# Altium schematic sheet Reference.SchDoc
size A3; SheetNumber: 7; SheetTotal: 8
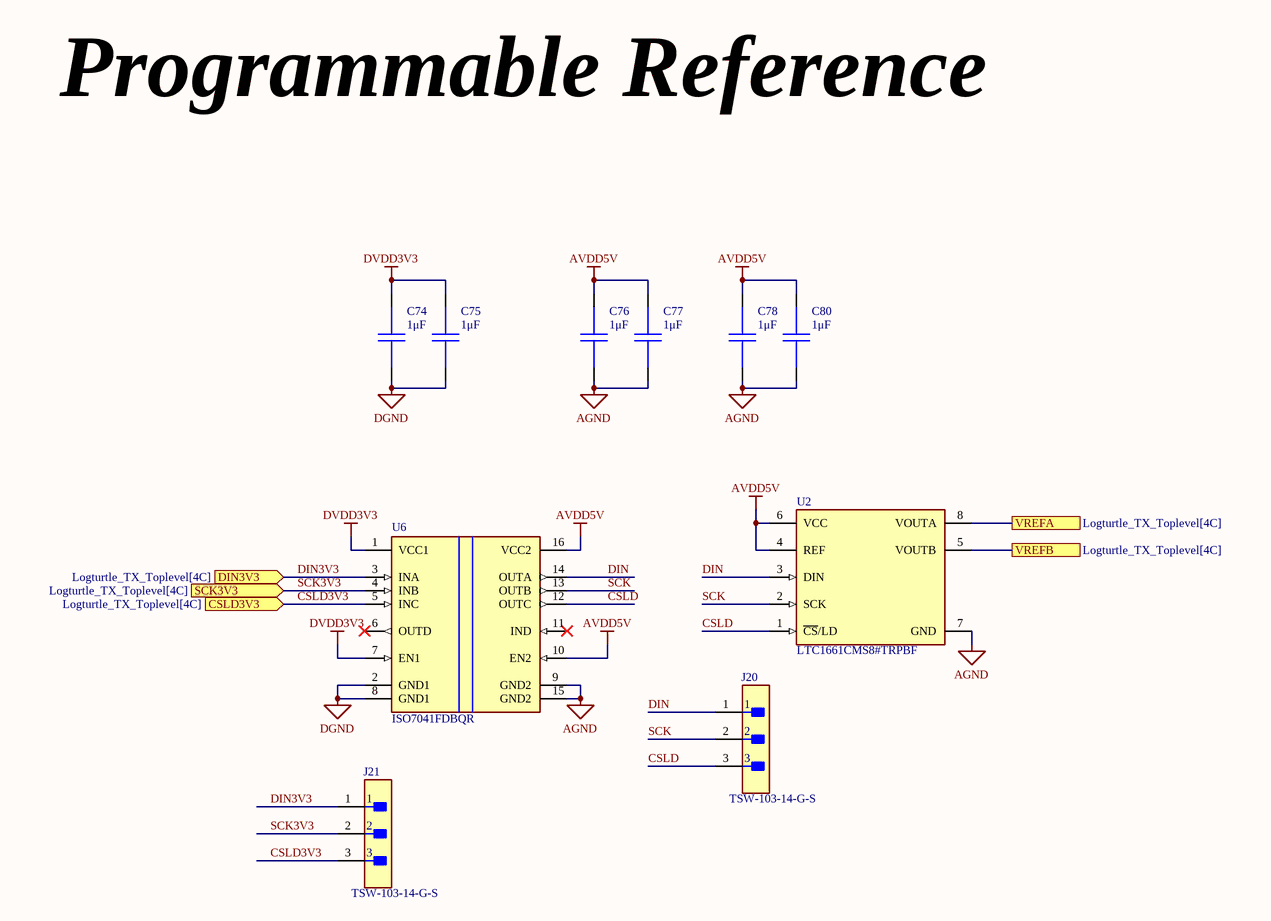
[diagram p0: Reference.SchDoc]

## Parts
C74  1μF  [CAPC1608X09N]
C75  1μF  [CAPC1608X09N]
C76  1μF  [CAPC1608X09N]
C77  1μF  [CAPC1608X09N]
C78  1μF  [CAPC1608X09N]
C80  1μF  [CAPC1608X09N]
J20  TSW-103-14-G-S  [FP-TSW-103-14-G-S-MFG]
J21  TSW-103-14-G-S  [FP-TSW-103-14-G-S-MFG]
U2  LTC1661CMS8#TRPBF  [FP-MS8-8-05-08-1660-IPC_B]
U6  ISO7041FDBQR  [FP-DBQ0016A-MFG]

## Ports
CSLD3V3 (in, see Logturtle_TX_Toplevel[4C]), DIN3V3 (in, see Logturtle_TX_Toplevel[4C]), SCK3V3 (in, see Logturtle_TX_Toplevel[4C]), VREFA (see Logturtle_TX_Toplevel[4C]), VREFB (see Logturtle_TX_Toplevel[4C])

## Nets
AGND: C76.1 C77.1 C78.1 C80.1 U2.7(GND) U6.9(GND2) U6.15(GND2)
AVDD5V: C76.2 C77.2 C78.2 C80.2 U2.4(REF) U2.6(VCC) U6.10(EN2) U6.16(VCC2)
DGND: C74.1 C75.1 U6.2(GND1) U6.8(GND1)
DVDD3V3: C74.2 C75.2 U6.1(VCC1) U6.7(EN1)
CSLD: J20.3 U2.1(~{CS}/LD) U6.12(OUTC)
CSLD3V3: J21.3 U6.5(INC) ; port CSLD3V3
DIN: J20.1 U2.3(DIN) U6.14(OUTA)
DIN3V3: J21.1 U6.3(INA) ; port DIN3V3
SCK: J20.2 U2.2(SCK) U6.13(OUTB)
SCK3V3: J21.2 U6.4(INB) ; port SCK3V3
VREFA: U2.8(VOUTA) ; port VREFA
VREFB: U2.5(VOUTB) ; port VREFB

Not connected (* = marked no-connect by the designer): U6 6(OUTD)* 11(IND)*

## Notes on the sheet
- Programmable Reference

## Library data of the parts
C74-C78 C80 = CC0603KRX7R7BB105: Ceramic Capacitor, Multilayer, Ceramic, 16V, 10% +Tol, 10% -Tol, X7R, 15% TC, 1uF, Surface Mount, 0603 https://www.digikey.ie/en/products/detail/yageo/CC0603KRX7R7BB105/2833611; Manufacturer: Yageo; Multilayer: Yes; Supplier: Digikey; Supplier Part Number: 311-1446-6-ND; Manufacturer Part Number: CC0603KRX7R7BB105; RoHS: Yes; Category: Ceramic Capacitors; Stock: 9128438; Mounting Technology: Surface Mount; Pins: 2; Dielectric Material: Ceramic; Package Shape: Rectangular; Case/Package: 0603; Terminal Finish: Nickel; Min Operating Temperature: -55°C; Max Operating Temperature: 125°C; JESD-609 Code: e3; Value: 1uF; Capacitor Type: Ceramic; Tolerance  (fill in as +-): 10%; Package Style: SMTMeter; Packaging: Tape and Reel; Tolerance (fill in as +-): 10%; Rated DC Voltage (URdc): 16V; Temperature Characteristics Code: X7R; Termination: Wraparound; Length: 1.6mm; Width: 0.8mm; Height: 0.8mm; Reach SVHC Compliant: Yes; RoHS Compliant: Yes; ComponentLink1URL: https://datasheet.ciiva.com:443/pdfs/VipMasterIC/IC/YAGO/YAGO-S-A0003557223/YAGO-S-A0003557223-1.pdf?src-supplier=IHS+Markit; ComponentLink1Description: https://datasheet.ciiva.com:443/pdfs/VipMasterIC/IC/YAGO/YAGO-S-A0003557223/YAGO-S-A0003557223-1.pdf?src-supplier=IHS+Markit; ComponentLink2URL: https://datasheet.ciiva.com/8033/1734573-8033801.pdf?src-supplier=Element14; ComponentLink2Description: https://datasheet.ciiva.com/8033/1734573-8033801.pdf?src-supplier=Element14; ComponentLink3URL: https://datasheet.ciiva.com/8033/1734573-8033800.pdf?src-supplier=Element14; ComponentLink3Description: https://datasheet.ciiva.com/8033/1734573-8033800.pdf?src-supplier=Element14; ComponentLink4URL: https://datasheet.ciiva.com/7978/1489800-7978143.pdf?src-supplier=Element14; ComponentLink4Description: https://datasheet.ciiva.com/7978/1489800-7978143.pdf?src-supplier=Element14; ComponentLink5URL: https://datasheet.ciiva.com/28450/1489800-28450557.pdf?src-supplier=Element14; ComponentLink5Description: https://datasheet.ciiva.com/28450/1489800-28450557.pdf?src-supplier=Element14; ComponentLink6URL: https://datasheet.ciiva.com/176/mlccorderingcode-176789.pdf?src-supplier=Digikey; ComponentLink6Description: https://datasheet.ciiva.com/176/mlccorderingcode-176789.pdf?src-supplier=Digikey; ComponentLink7URL: https://datasheet.ciiva.com/176/mlccorderingcode-176788.pdf?src-supplier=Digikey; ComponentLink7Description: https://datasheet.ciiva.com/176/mlccorderingcode-176788.pdf?src-supplier=Digikey; ComponentLink8URL: https://datasheet.ciiva.com/176/mlccorderingcode-176790.pdf?src-supplier=Digikey; ComponentLink8Description: https://datasheet.ciiva.com/176/mlccorderingcode-176790.pdf?src-supplier=Digikey; ComponentLink9URL: https://datasheet.ciiva.com/5425/upy-gphc-x7r-6-3v-to-50v-8-12304-5425495.pdf?src-supplier=Mouser; ComponentLink9Description: https://datasheet.ciiva.com/5425/upy-gphc-x7r-6-3v-to-50v-8-12304-5425495.pdf?src-supplier=Mouser
J20 J21 = CMP-02766-001743-1: CONN HEADER VERT 3POS 2.54MM; Max Voltage Rating (AC): 550V; Number of Positions: 3; Max Current Rating: 7.6A; Gender: Male; Termination: Solder; RoHS Compliant: Yes; Mount: Through Hole; Lead Free: Lead Free; Connector Type: Header; REACH SVHC: No SVHC; Insulation Color: Black; Width: 2.54mm; Length: 7.62mm; Flammability Rating: UL94 V-0; Housing Material: Polyester; Contact Material: Bronze; Max Operating Temperature: 125°C; Fastening Type: Pull; Series: TSW; Number of Contacts: 3; Packaging: Bulk; Min Operating Temperature: -55°C; Package Quantity: 1; Height: 10.67mm; Pitch: 2.54mm; Contact Finish - Mating: GOLD; Contact Type: Male Pin; Radiation Hardening: No; Color: Black; Housing Color: Black; Contact Plating: Gold; Orientation: Straight; Number of Rows: 1; Depth: 2.54mm; Insulation Material: PBT; Contact Mating Length: 0.32inch; Contact Shape: Square
U2 = CMP-09082-000102-1: IC DAC 10BIT V-OUT 8MSOP; Output Type: Voltage; Min Supply Voltage: 2.7V; Interface: Serial; Integral Nonlinearity (INL): 2LSB; Resolution: 10b; Max Supply Voltage: 5.5V; Number of Bits: 10; Supply Type: Single; Settling Time: 30us; Number of Converters: 2; Min Operating Temperature: 0°C; Lead Free: Lead Free; Number of Pins: 8; Packaging: Tape and Reel; Mount: Surface Mount; Max Operating Temperature: 70°C; Package Quantity: 2500; Number of Channels: 2; Case/Package: MSOP
U6 = CMP-04872-000242-1: DGTL ISO 3000VRMS 4CH GP 16SSOP; RoHS Compliant: Yes